# Altium schematic sheet MAIN.SchDoc
size A3; Organization: Electronic Research & Design; Address1: 11 Granofier; Address2: Zwartkop; Address3: Centurion; Address4: South Africa; Revision: 1; SheetNumber: 1; SheetTotal: 1; ProjectName: Flir
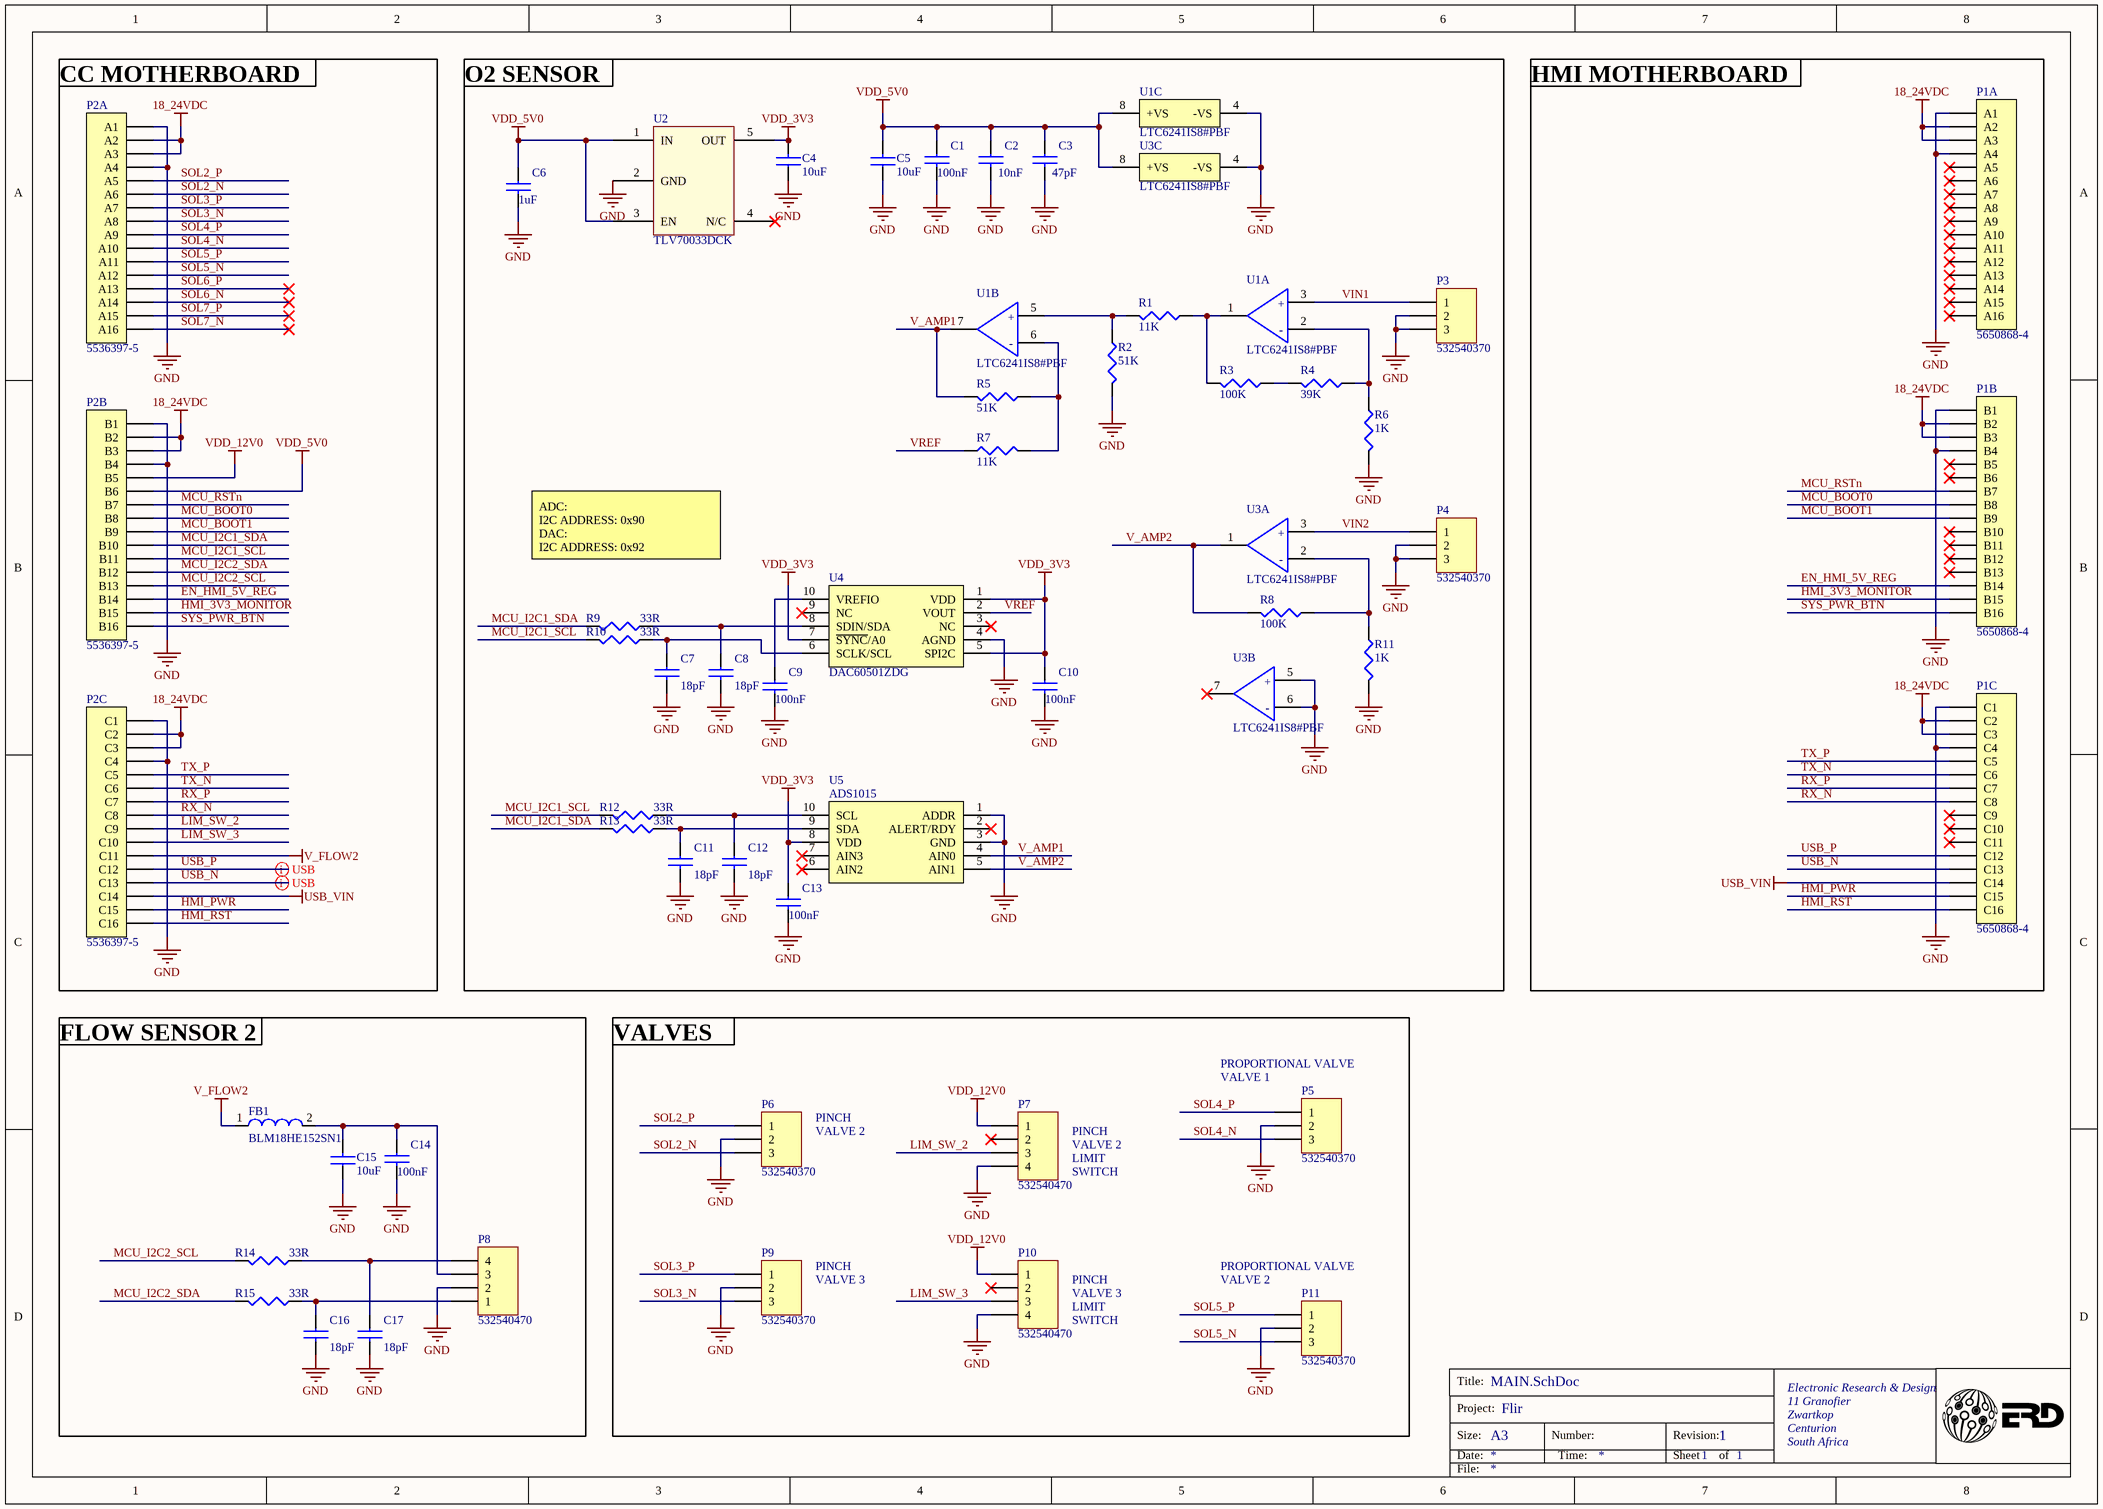
[diagram p0: MAIN.SchDoc]

## Parts
C1  100nF  [CC0402]
C2  10nF  [CC0402]
C3  47pF  [CC0402]
C4  10uF  [CC0603]
C5  10uF  [CC0603]
C6  1uF  [CC0402]
C7  18pF  [CC0402]
C8  18pF  [CC0402]
C9  100nF  [CC0402]
C10  100nF  [CC0402]
C11  18pF  [CC0402]
C12  18pF  [CC0402]
C13  100nF  [CC0402]
C14  100nF  [CC0402]
C15  10uF  [CC0603]
C16  18pF  [CC0402]
C17  18pF  [CC0402]
FB1  BLM18HE152SN1  [LC0603]
P1  5650868-4  [5650868-4_F_RA]  (parts A,B,C of 3)
P2  5536397-5  (parts A,B,C of 3)
P3  532540370  [HDR1X3]
P4  532540370  [HDR1X3]
P5  532540370  [HDR1X3]
P6  532540370  [HDR1X3]
P7  532540470  [HDR1X4]
P8  532540470  [HDR1X4]
P9  532540370  [HDR1X3]
P10  532540470  [HDR1X4]
P11  532540370  [HDR1X3]
R1  11K  [RC0402]
R2  51K  [RC0402]
R3  100K  [RC0402]
R4  39K  [RC0402]
R5  51K  [RC0402]
R6  1K  [RC0402]
R7  11K  [RC0402]
R8  100K  [RC0402]
R9  33R  [RC0402]
R10  33R  [RC0402]
R11  1K  [RC0402]
R12  33R  [RC0402]
R13  33R  [RC0402]
R14  33R  [RC0402]
R15  33R  [RC0402]
U1  LTC6241IS8#PBF  [SOIC-8]  (parts A,B,C of 3)
U2  TLV70033DCK  [SC-70-5]
U3  LTC6241IS8#PBF  [SOIC-8]  (parts A,B,C of 3)
U4  DAC60501ZDG  [VSSOP-10]
U5  ADS1015  [VSSOP-10]

## Nets
18_24VDC: P1.2(A2) P1.3(A3) P1.18(B2) P1.19(B3) P1.34(C2) P1.35(C3) P2.2(A2) P2.3(A3) P2.18(B2) P2.19(B3) P2.34(C2) P2.35(C3)
GND: C1.2 C2.2 C3.2 C4.1 C5.1 C6.2 C7.2 C8.2 C9.2 C10.2 C11.2 C12.2 C13.2 C14.2 C15.1 C16.2 C17.2 P1.1(A1) P1.4(A4) P1.17(B1) P1.20(B4) P1.33(C1) P1.36(C4) P2.1(A1) P2.4(A4) P2.17(B1) P2.20(B4) P2.33(C1) P2.36(C4) P3.2 P3.3 P4.2 P4.3 P5.2 P6.2 P7.4 P8.2 P9.2 P10.4 P11.2 R2.2 R6.2 R11.2 U1.4(-VS) U2.2(GND) U3.4(-VS) U3.5(+IN2) U3.6(-IN2) U4.4(AGND) U5.1(ADDR) U5.3(GND)
USB_VIN: P1.46(C14) P2.46(C14)
V_FLOW2: FB1.1 P2.43(C11)
VDD_3V3: C4.2 C10.1 C13.1 U2.5(OUT) U4.1(VDD) U4.5(SPI2C) U4.7(~{SYNC}/A0) U5.8(VDD)
VDD_5V0: C1.1 C2.1 C3.1 C5.2 C6.1 P2.22(B6) U1.8(+VS) U2.1(IN) U2.3(EN) U3.8(+VS)
VDD_12V0: P2.21(B5) P7.1 P10.1
EN_HMI_5V_REG: P1.30(B14) P2.30(B14)
HMI_3V3_MONITOR: P1.31(B15) P2.31(B15)
HMI_PWR: P1.47(C15) P2.47(C15)
HMI_RST: P1.48(C16) P2.48(C16)
LIM_SW_2: P2.41(C9) P7.3
LIM_SW_3: P2.42(C10) P10.3
MCU_BOOT0: P1.24(B8) P2.24(B8)
MCU_BOOT1: P1.25(B9) P2.25(B9)
MCU_I2C1_SCL: P2.27(B11) R10.2 R12.2
MCU_I2C1_SDA: P2.26(B10) R9.2 R13.2
MCU_I2C2_SCL: P2.29(B13) R14.2
MCU_I2C2_SDA: P2.28(B12) R15.2
MCU_RSTn: P1.23(B7) P2.23(B7)
RX_N: P1.40(C8) P2.40(C8)
RX_P: P1.39(C7) P2.39(C7)
SOL2_N: P2.6(A6) P6.3
SOL2_P: P2.5(A5) P6.1
SOL3_N: P2.8(A8) P9.3
SOL3_P: P2.7(A7) P9.1
SOL4_N: P2.10(A10) P5.3
SOL4_P: P2.9(A9) P5.1
SOL5_N: P2.12(A12) P11.3
SOL5_P: P2.11(A11) P11.1
SOL6_N: P2.14(A14)
SOL6_P: P2.13(A13)
SOL7_N: P2.16(A16)
SOL7_P: P2.15(A15)
SYS_PWR_BTN: P1.32(B16) P2.32(B16)
TX_N: P1.38(C6) P2.38(C6)
TX_P: P1.37(C5) P2.37(C5)
USB_N: P1.45(C13) P2.45(C13)
USB_P: P1.44(C12) P2.44(C12)
V_AMP1: R5.2 U1.7(OUT2) U5.4(AIN0)
V_AMP2: R8.2 U3.1(OUT1) U5.5(AIN1)
VIN1: P3.1 U1.3(+IN1)
VIN2: P4.1 U3.3(+IN1)
VREF: R7.1 U4.2(VOUT)
NetC7_1: C7.1 R10.1 U4.6(SCLK/SCL)
NetC8_1: C8.1 R9.1 U4.8(SDIN/SDA)
NetC9_1: C9.1 U4.10(VREFIO)
NetC11_1: C11.1 R13.1 U5.9(SDA)
NetC12_1: C12.1 R12.1 U5.10(SCL)
NetC14_1: C14.1 C15.2 FB1.2 P8.3
NetC16_1: C16.1 P8.1 R15.1
NetC17_1: C17.1 P8.4 R14.1
NetR1_1: R1.1 R3.2 U1.1(OUT1)
NetR1_2: R1.2 R2.1 U1.5(+IN2)
NetR3_1: R3.1 R4.2
NetR4_1: R4.1 R6.1 U1.2(-IN1)
NetR5_1: R5.1 R7.2 U1.6(-IN2)
NetR8_1: R8.1 R11.1 U3.2(-IN1)

Not connected (* = marked no-connect by the designer): P1 5(A5)* 6(A6)* 7(A7)* 8(A8)* 9(A9)* 10(A10)* 11(A11)* 12(A12)* 13(A13)* 14(A14)* 15(A15)* 16(A16)* 21(B5)* 22(B6)* 26(B10)* 27(B11)* 28(B12)* 29(B13)* 41(C9)* 42(C10)* 43(C11)*; P7 2*; P10 2*; U2 4(N/C)*; U3 7(OUT2)*; U4 3(NC)* 9(NC)*; U5 2(ALERT/RDY)* 6(AIN2)* 7(AIN3)*

## Layout directives
differential pair: USB_N, USB_P

## Notes on the sheet
- (near P2) CC MOTHERBOARD
- O2 SENSOR
- HMI MOTHERBOARD
- ADC:
  I2C ADDRESS: 0x90
  DAC:
  I2C ADDRESS: 0x92
- FLOW SENSOR 2
- VALVES
- PINCH
- (near P5) PROPORTIONAL VALVE
- (near P5) VALVE 1
- VALVE 2
- LIMIT
- SWITCH
- VALVE 3
- (near P11) PROPORTIONAL VALVE
- (near P11) VALVE 2
- Title:
- Size:
- Date:
- Project:
- A3
- Number:
- Time:
- Revision:
- Sheet
- of
- File:
- (in symbol AD823A, part A) +; -
- (in symbol AD823A, part B) +; -

## Library data of the parts
C1 C9 C10 C13 C14 = CAP CER 0.1UF 10V 10% X5R 0402: CAP CER 0.1UF 50V 10% X7R 0402; Manufacturer: Murata; Part Number: GCM155R71H104KE02D; Package / Case: 0402 (1005 Metric); Supplier: AAD
C2 = CAP CER 0.1UF 10V 10% X5R 0402: CAP CER 10NF 50V 10% X7R 0402; Manufacturer: Murata; Part Number: GRM155R71H103KA88J; Package / Case: 0402; Voltage Rating: 50V
C3 = CAP CER 0.1UF 10V 10% X5R 0402: CAP CER 47PF 50V 5% C0G/NP0 0402; Manufacturer: Murata; Part Number: GCM1555C1H470JA16D; Package / Case: 0402; Voltage Rating: 50V
C4 C5 C15 = CAP CER 0.1UF 10V 10% X5R 0402: CAP CER 10UF 25V 20% X5R 0603; Manufacturer: Murata; PartNumber: GRM188R61E106MA73D; Package / Case: 0603; Supplier: AAD
C6 = CAP CER 0.1UF 10V 10% X5R 0402: CAP CER 1UF 10V 20% X5R 0402; Manufacturer: Murata; Part Number: GRM153R61A105ME95D; Package / Case: 0402 (1005 Metric); Supplier: AAD
C7 C8 C11 C12 C16 C17 = CAP CER 2.2UF 6.3V 10% X5R 0402: CAP CER 18pF 50V 5% C0G 0402; Manufacturer: AVX; PartNumber: GJM1555C1H180FB01D; Package / Case: 0402 (1005 Metric); Supplier: AAD; Supplier Stock Code: N/A
FB1 = FER_180_200_0: FERRITE, 500mA, 500mOHM, 0603; PartNumber: BLM18HE152SN1
P1 = DIN_41612_3x16: DIN-41612, R/2, 48-circuit, 3x16, 2.54mm pitch, RA, TH; Manufacturer: TE Connectivity; PartNumber: 5650868-4
P2 = DIN_41612_3x16: DIN-41612, C/2, 48-circuit, 3x16, 2.54mm pitch, TH; Manufacturer: TE CONNECTIVITY; PartNumber: 5536397-5
P3-P6 P9 P11 = Header 3: Header, RA, 3-circuit, 2mm pitch, TH; Manufacturer: Molex; PartNumber: 532540370
P7 P8 P10 = Header 4: Header, RA, 4-circuit, 2mm pitch, TH; Manufacturer: Molex; PartNumber: 532540470
R1 R7 = RES_10K_1/16W_1%_0402: RES, 11K OHM, 1/16W, 1%, 0402; Manufacturer: Yageo; PartNumber: RC0402FR-0711KL; Package / Case: 0402 (1005 Metric); Supplier: AAD
R2 R5 = RES_10K_1/16W_1%_0402: RES, 51K OHM, 1/16W, 1%, 0402; Manufacturer: Yageo; PartNumber: RC0402FR-0751KL; Package / Case: 0402 (1005 Metric); Supplier: AAD
R3 R8 = RES_10K_1/16W_1%_0402: RES, 100K OHM, 1/16W, 1%, 0402; Manufacturer: Yageo; PartNumber: RC0402FR-07100KL; Package / Case: 0402 (1005 Metric); Supplier: AAD
R4 = RES_10K_1/16W_1%_0402: RES, 39K OHM, 1/16W, 1%, 0402; Manufacturer: Yageo; PartNumber: RC0402FR-0739KL; Package / Case: 0402 (1005 Metric); Supplier: AAD
R6 R11 = RES_10K_1/16W_1%_0402: RES, 1K OHM, 1/16W, 1%, 0402; Manufacturer: Yageo; PartNumber: RC0402FR-071KL; Package / Case: 0402 (1005 Metric); Supplier: AAD
R9 R10 R12-R15 = RES_10K_1/16W_1%_0402: RES, 33 OHM, 1/16W, 1%, 0402; Manufacturer: Yageo; PartNumber: RC0402FR-0733RL; Package / Case: 0402 (1005 Metric); Supplier: AAD
U1 U3 = AD823A: Op-AMP, Dual, 18MHz, SOIC-8; PartNumber: LTC6241IS8#PBF
U2 = TLV700: LDO, 3.3V, 200mA, SC70-5; PartNumber: TLV70033DCK
U4 = DAC60501: DAC, 12-bit, I2C, VSSOP-10; PartNumber: DAC60501ZDG
U5 = ADS1015: ADC, 12-bit, I2C, 4-channel, VSSOP-10; PartNumber: ADS1015